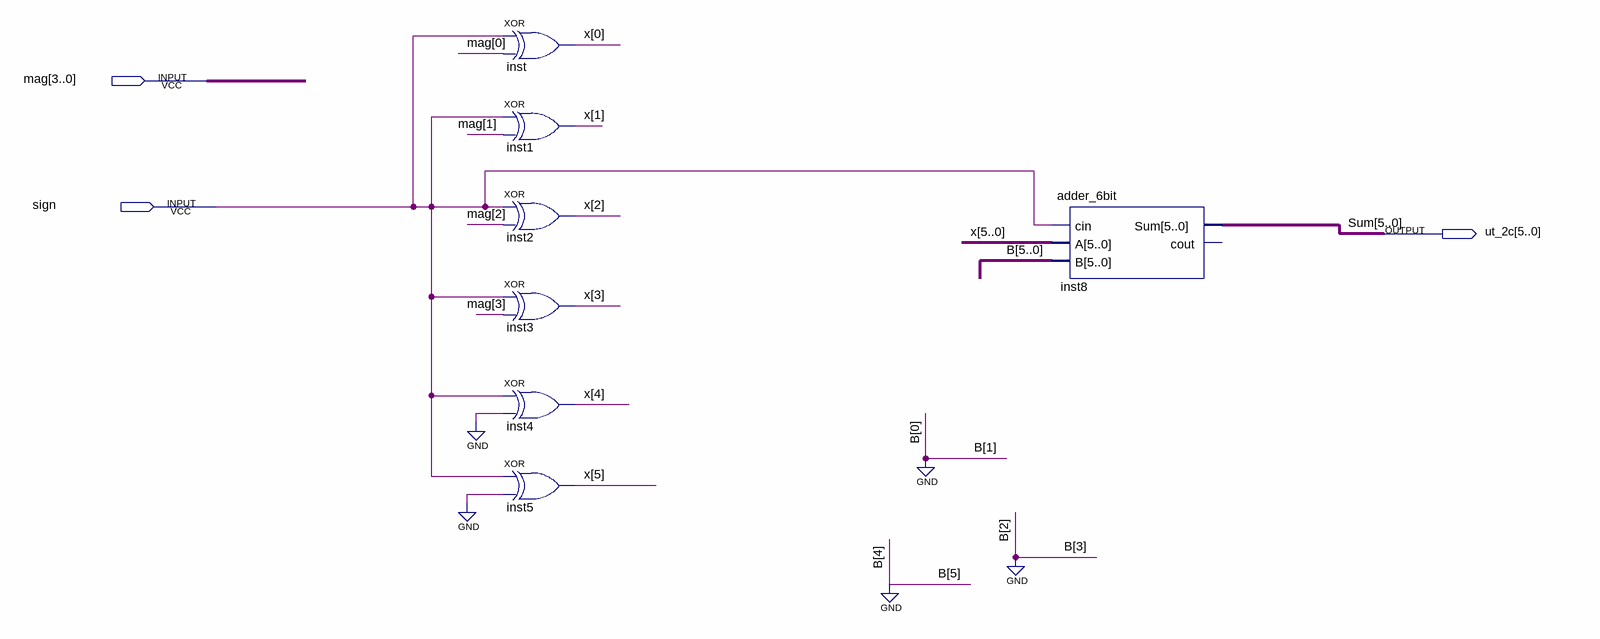
[diagram p0: schematic sheet]
// Quartus schematic sm_to_2c_6bit.bdf as structural Verilog: 7 symbols, 3 pins
module sm_to_2c_6bit (
  input  [3:0] mag,
  input  sign,
  output [5:0] ut_2c
);

  wire [5:0] x;

  xor inst (x[0], sign, mag[0]);
  xor inst1 (x[1], sign, mag[1]);
  xor inst2 (x[2], sign, mag[2]);
  xor inst3 (x[3], sign, mag[3]);
  xor inst4 (x[4], sign, 1'b0);
  xor inst5 (x[5], sign, 1'b0);
  adder_6bit inst8 (.cin(sign), .A(x), .B({6{1'b0}}), .Sum(ut_2c));  // open: cout

  // Other names for the same wires on the sheet: Sum[5:0] = ut_2c
endmodule
